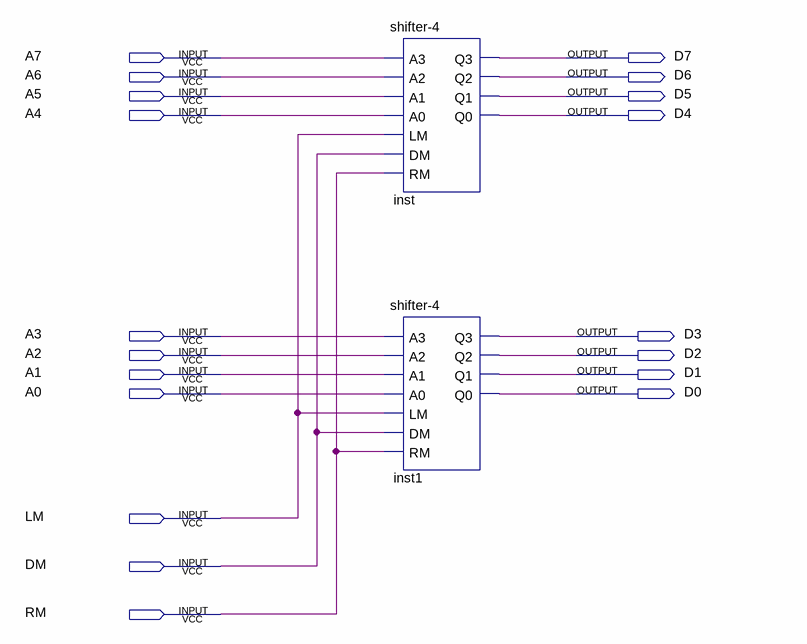
[diagram p0: schematic sheet]
// Quartus schematic logical-shifter-8.bdf as structural Verilog: 2 symbols, 19 pins
module \logical-shifter-8  (
  input  A7,
  input  A6,
  input  A5,
  input  A4,
  input  A3,
  input  A2,
  input  A1,
  input  A0,
  input  LM,
  input  DM,
  input  RM,
  output D7,
  output D6,
  output D5,
  output D4,
  output D3,
  output D2,
  output D1,
  output D0
);

  \shifter-4  inst (.A3(A7), .A2(A6), .A1(A5), .A0(A4), .LM(LM), .DM(DM), .RM(RM), .Q3(D7), .Q2(D6), .Q1(D5), .Q0(D4));
  \shifter-4  inst1 (.A3(A3), .A2(A2), .A1(A1), .A0(A0), .LM(LM), .DM(DM), .RM(RM), .Q3(D3), .Q2(D2), .Q1(D1), .Q0(D0));
endmodule
